# EAGLE design Micromouse v2 (EAGLE 9.6.2)
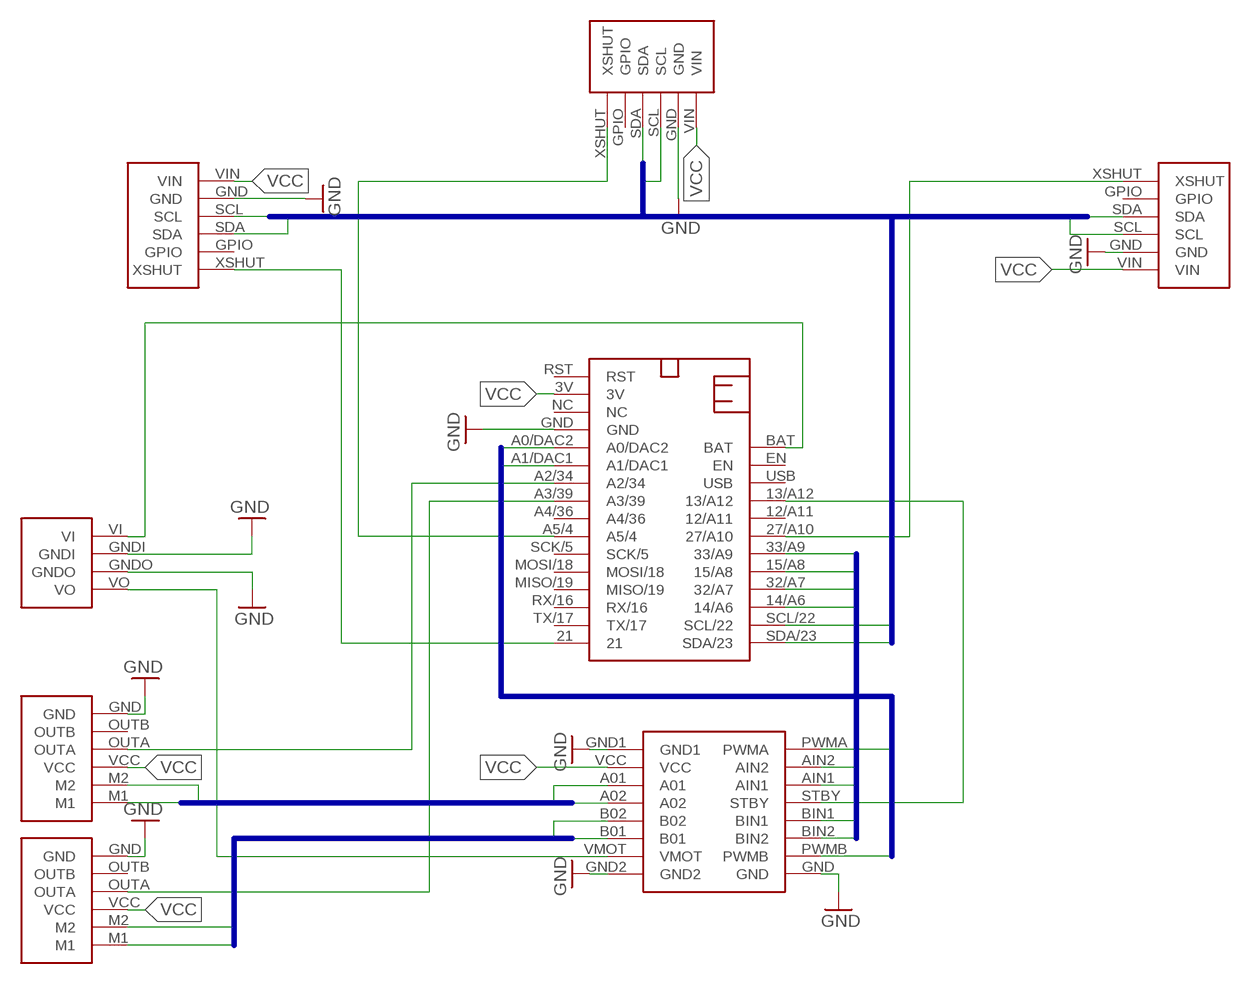
[diagram p0: schematic, sheet 1]

## Parts
12VBOOST1  12VBOOST  [12VBOOST]
ENCODE_A2  ENCODE  [ENCODE]
ENCODE_A3  ENCODE  [ENCODE]
ESP1  ESP32  [ESP32]
MOTOR1  MOTOR  [MOTOR]
VL_21  VL6180  [VL6180]
VL_27  VL6180  [VL6180]
VL_A5  VL6180  [VL6180]

## Nets
AIN1: ESP1.33/A9 MOTOR1.AIN1
AIN2: ESP1.15/A8 MOTOR1.AIN2
BIN1: ESP1.32/A7 MOTOR1.BIN1
BIN2: ESP1.14/A6 MOTOR1.BIN2
BOOST_IN [12V]: 12VBOOST1.VI ESP1.BAT
BOOST_OUT [12V]: 12VBOOST1.VO MOTOR1.VMOT
GND: 12VBOOST1.GNDI 12VBOOST1.GNDO ENCODE_A2.GND ENCODE_A3.GND ESP1.GND MOTOR1.GND MOTOR1.GND1 MOTOR1.GND2 VL_21.GND VL_27.GND VL_A5.GND
MA1 [12V]: ENCODE_A2.M1 MOTOR1.A01
MA2 [12V]: ENCODE_A2.M2 MOTOR1.A02
MB1 [12V]: ENCODE_A3.M1 MOTOR1.B01
MB2 [12V]: ENCODE_A3.M2 MOTOR1.B02
N$11: ESP1.13/A12 MOTOR1.STBY
N$15: ENCODE_A2.OUTA ESP1.A2/34
N$16: ENCODE_A3.OUTA ESP1.A3/39
N$18: ESP1.27/A10 VL_27.XSHUT
N$19: ESP1.21 VL_21.XSHUT
N$20: ESP1.A5/4 VL_A5.XSHUT
PWMA: ESP1.A1/DAC1 MOTOR1.PWMA
PWMB: ESP1.A0/DAC2 MOTOR1.PWMB
SCL: ESP1.SCL/22 VL_21.SCL VL_27.SCL VL_A5.SCL
SDA: ESP1.SDA/23 VL_21.SDA VL_27.SDA VL_A5.SDA
VCC: ENCODE_A2.VCC ENCODE_A3.VCC ESP1.3V MOTOR1.VCC VL_21.VIN VL_27.VIN VL_A5.VIN
Unconnected: ENCODE_A2.OUTB ENCODE_A3.OUTB ESP1.12/A11 ESP1.A4/36 ESP1.EN ESP1.MISO/19 ESP1.MOSI/18 ESP1.NC ESP1.RST ESP1.RX/16 ESP1.SCK/5 ESP1.TX/17 ESP1.USB VL_21.GPIO VL_27.GPIO VL_A5.GPIO

## Buses
I2C:SCL,SDA
MA:MA1,MA2
MB:MB1,MB2
PWM:PWMA,PWMB
MOTOR:AIN[1..2],BIN[1..2]

## Library data of the parts
12VBOOST1 = micromouse:12VBOOST
ENCODE_A2 ENCODE_A3 = micromouse:ENCODE
ESP1 = micromouse:ESP32
MOTOR1 = micromouse:MOTOR
VL_21 VL_27 VL_A5 = micromouse:VL6180

## Net classes
0 default: width 0.406 mm, drill 0.508 mm, clearance 0.254 mm
1 12V: width 0.61 mm, drill 0.508 mm, clearance 0.406 mm to class 0, clearance 0.406 mm

## Board
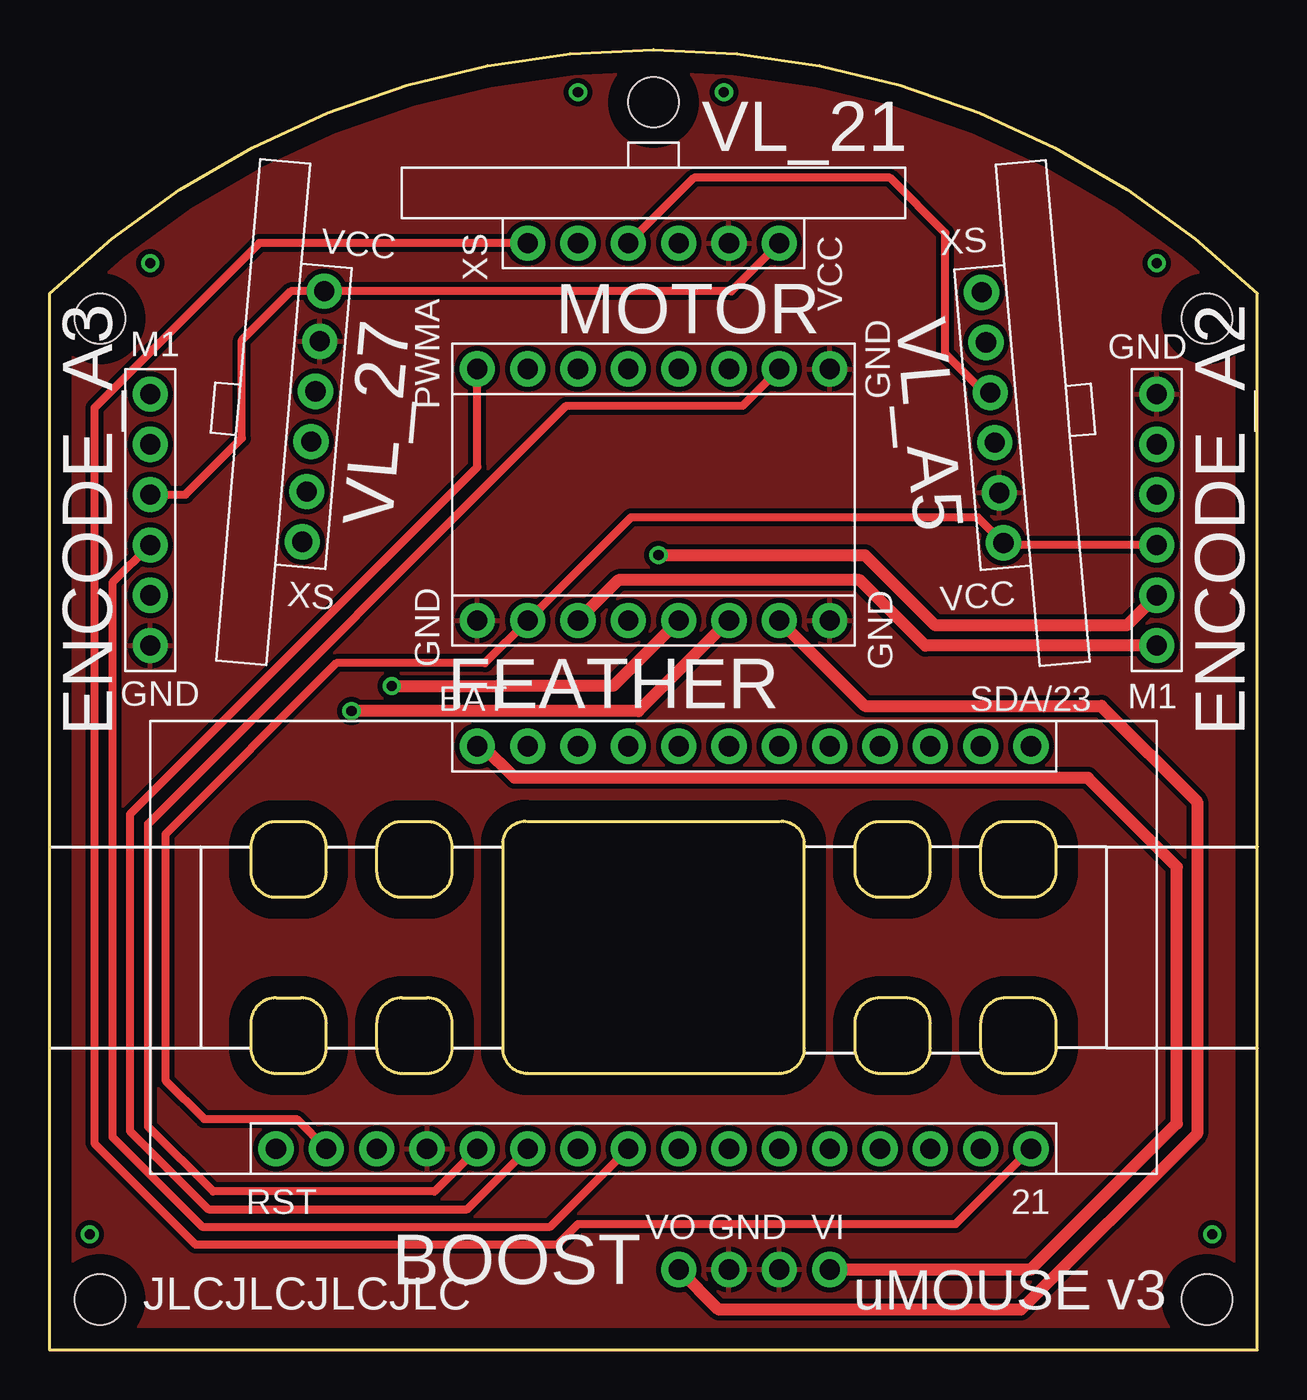
[diagram p1: board, top side]
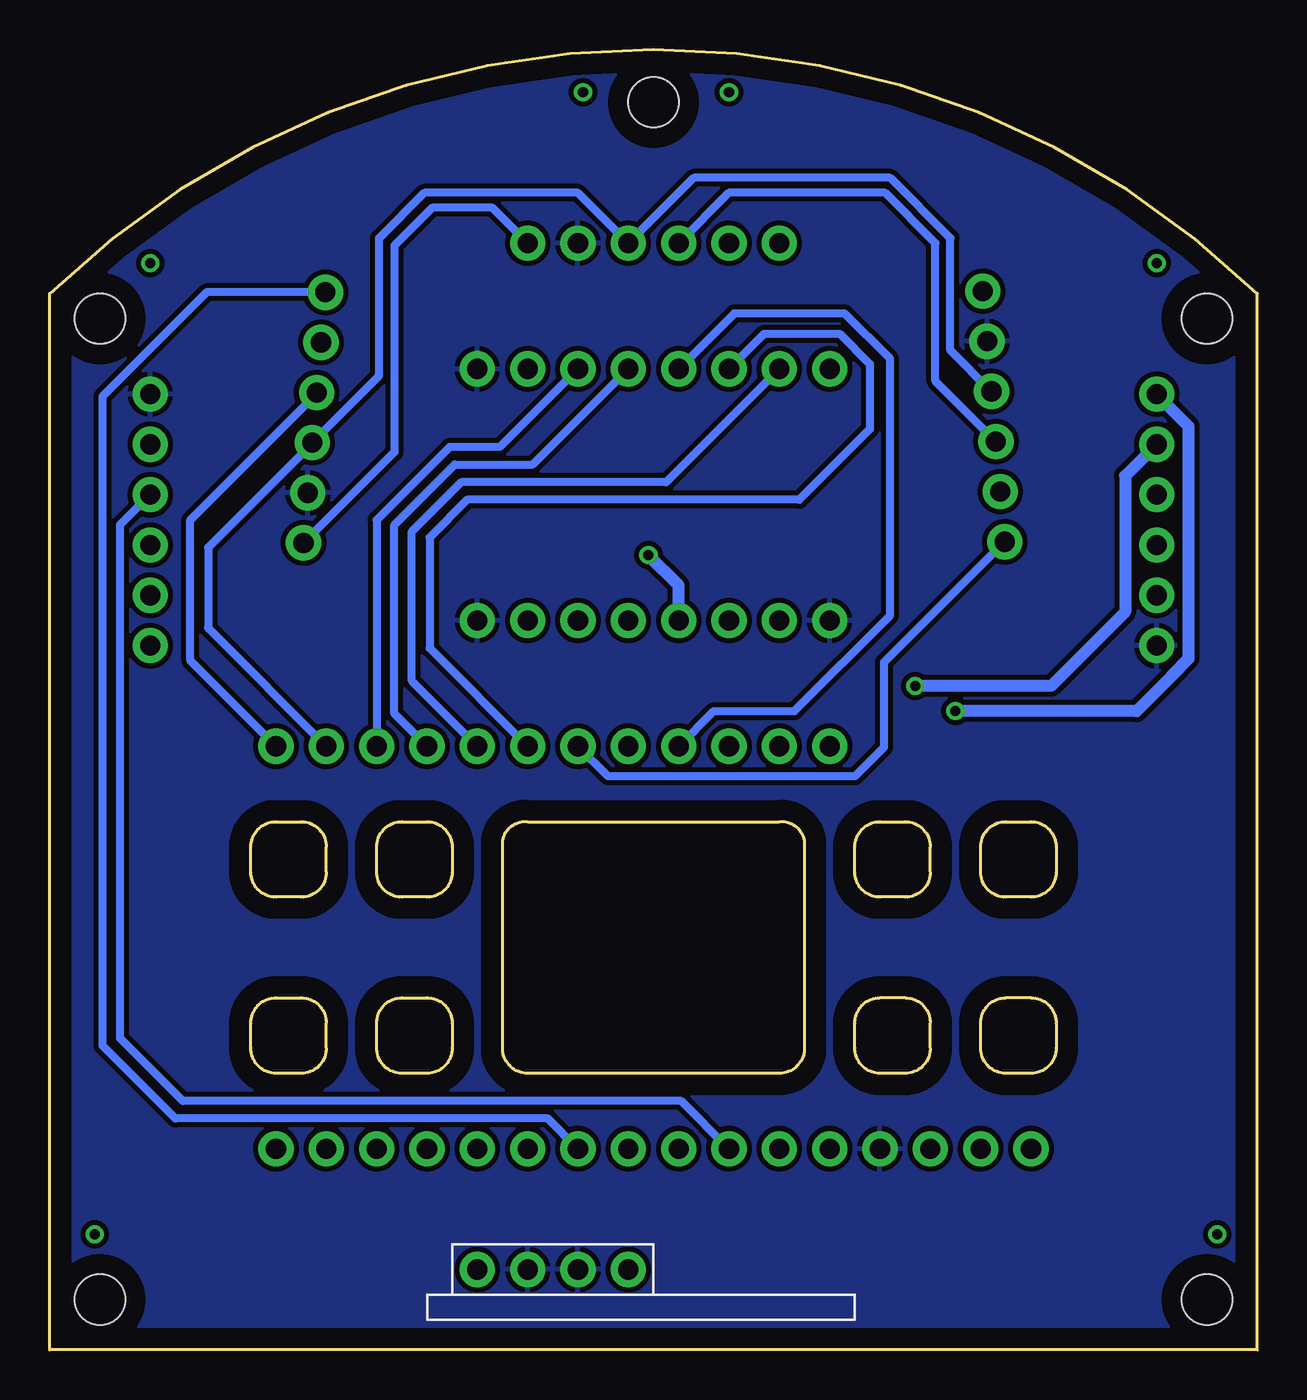
[diagram p2: board, bottom side, seen from below]

Size 60.96 x 65.65 mm. Coordinates in mm from the lower left corner, seen from the top.
Outline: 0,0 0,53.34 arc-88 60.96,53.34 60.96,0 0,0
Outline: 22.86,25.65 22.86,15.24 arc90 24.13,13.97 36.83,13.97 arc90 38.1,15.24 38.1,25.65 arc90 36.83,26.67 24.13,26.67 arc90 22.86,25.65
Outline: 20.32,24.13 20.32,25.4 arc90 19.05,26.67 17.78,26.67 arc90 16.51,25.4 16.51,24.13 arc90 17.78,22.86 19.05,22.86 arc90 20.32,24.13
Outline: 12.7,26.67 11.43,26.67 arc90 10.16,25.4 10.16,24.13 arc90 11.43,22.86 12.7,22.86 arc90 13.97,24.13 13.97,25.4 arc90 12.7,26.67
Outline: 20.32,15.24 20.32,16.51 arc90 19.05,17.78 17.78,17.78 arc90 16.51,16.51 16.51,15.24 arc90 17.78,13.97 19.05,13.97 arc90 20.32,15.24
Outline: 11.43,17.78 arc90 10.16,16.51 10.16,15.24 arc90 11.43,13.97 12.7,13.97 arc90 13.97,15.24 13.97,16.51 arc90 12.7,17.78 11.43,17.78
Outline: 50.8,15.24 50.8,16.51 arc90 49.53,17.78 48.26,17.78 arc90 46.99,16.51 46.99,15.24 arc90 48.26,13.97 49.53,13.97 arc90 50.8,15.24
Outline: 43.18,17.78 41.91,17.78 arc90 40.64,16.51 40.64,15.24 arc90 41.91,13.97 43.18,13.97 arc90 44.45,15.24 44.45,16.51 arc90 43.18,17.78
Outline: 50.8,24.13 50.8,25.4 arc90 49.53,26.67 48.26,26.67 arc90 46.99,25.4 46.99,24.13 arc90 48.26,22.86 49.53,22.86 arc90 50.8,24.13
Outline: 43.18,26.67 41.91,26.67 arc90 40.64,25.4 40.64,24.13 arc90 41.91,22.86 43.18,22.86 arc90 44.45,24.13 44.45,25.4 arc90 43.18,26.67
Copper layers (1*16): Top 0.035mm / dielectric 1.5mm / Bottom 0.035mm
Design rules "default": minimum track width 6mil, minimum drill 0.35mm, track to track 6mil, track to pad 6mil, pad to pad 6mil, via to via 6mil, smd to smd 6mil, copper to edge 40mil, drill to drill 6mil, minimum pad ring 10mil, minimum via ring 8mil, stop-mask expansion 4mil, vias tented up to drill 0mil, thermal gap 10mil
Holes 2.54 mm at 30.48,62.99 2.54,52.07 2.54,2.54 58.42,2.54 58.42,52.07

### Footprints (pad centres in the part's own frame; a part is rotated, then mirrored left to right if it is on the bottom)
12VBOOST = drill 1.016 pad 1.778: GNDI 6.35,1.27; GNDO 3.81,1.27; VI 8.89,1.27; VO 1.27,1.27
ENCODE = drill 1.016 pad 1.778: GND 1.27,1.27; M1 1.27,13.97; M2 1.27,11.43; OUTA 1.27,6.35; OUTB 1.27,3.81; VCC 1.27,8.89
ESP32 = drill 1.016 pad 1.778: 3V 1.27,41.91; 12/A11 21.59,24.13; 13/A12 21.59,26.67; 14/A6 21.59,11.43; 15/A8 21.59,16.51; 21 1.27,6.35; 27/A10 21.59,21.59; 32/A7 21.59,13.97; 33/A9 21.59,19.05; A0/DAC2 1.27,34.29; A1/DAC1 1.27,31.75; A2/34 1.27,29.21; A3/39 1.27,26.67; A4/36 1.27,24.13; A5/4 1.27,21.59; BAT 21.59,34.29; EN 21.59,31.75; GND 1.27,36.83; MISO/19 1.27,13.97; MOSI/18 1.27,16.51; NC 1.27,39.37; RST 1.27,44.45; RX/16 1.27,11.43; SCK/5 1.27,19.05; SCL/22 21.59,8.89; SDA/23 21.59,6.35; TX/17 1.27,8.89; USB 21.59,29.21
MOTOR = drill 1.016 pad 1.778: A01 1.27,13.97; A02 1.27,11.43; AIN1 13.97,13.97; AIN2 13.97,16.51; B01 1.27,6.35; B02 1.27,8.89; BIN1 13.97,8.89; BIN2 13.97,6.35; GND 13.97,1.27; GND1 1.27,19.05; GND2 1.27,1.27; PWMA 13.97,19.05; PWMB 13.97,3.81; STBY 13.97,11.43; VCC 1.27,16.51; VMOT 1.27,3.81
VL6180 = drill 1.016 pad 1.778: GND 1.27,3.81; GPIO 1.27,11.43; SCL 1.27,6.35; SDA 1.27,8.89; VIN 1.27,1.27; XSHUT 1.27,13.97

### Placement (x,y rotation side)
12VBOOST1  30.48,5.33 180 bottom
ENCODE_A2  57.15,49.53 180 top
ENCODE_A3  3.81,34.29 0 top
ESP1  55.88,8.89 90 top
MOTOR1  40.64,35.56 90 top
VL_21  38.1,54.61 90 top
VL_27  15.24,54.61 175 top
VL_A5  46.99,39.37 5 top

### Tracks (layer width: path | path; a pad name or v marks a point on that pad's centre or on a via)
AIN1
  Bottom 0.406: ESP1.33/A9 41.78,35.43 41.78,41.02 39.88,42.93 23.11,42.93 19.56,46.48 19.56,49.78 21.08,51.31 24.89,51.31 MOTOR1.AIN1
AIN2
  Bottom 0.406: ESP1.15/A8 42.67,33.78 42.67,41.32 40.18,43.81 29.84,43.81 MOTOR1.AIN2
BIN1
  Bottom 0.406: ESP1.32/A7 43.56,32.13 43.56,41.66 40.51,44.7 36.58,44.7 MOTOR1.BIN1
BIN2
  Bottom 0.406: MOTOR1.BIN2 38.23,45.59 40.77,45.59 44.45,41.91 ESP1.14/A6
BOOST_IN
  Top 0.61: 12VBOOST1.VI 49.53,4.06 56.9,11.43 56.9,24.38 52.4,28.88 23.47,28.88 21.87,30.48 ESP1.BAT
BOOST_OUT
  Top 0.61: MOTOR1.VMOT 41.15,32.51 53.09,32.51 57.91,27.69 57.91,10.92 49.02,2.03 33.78,2.03 12VBOOST1.VO
GND
  pour Bottom: -2.54,-2.54 63.5,-2.54 63.5,68.58 -2.54,68.58
  pour Top: -1.27,-1.27 62.23,-1.27 62.23,66.04 0,66.04 -1.27,66.04
MA1
  Top 0.61: ENCODE_A2.M1 44.2,35.56 40.89,38.86 28.7,38.86 MOTOR1.A01
MA2  (via drill 0.51)
  Top 0.61: v30.73,40.13 41.15,40.13 44.7,36.58 54.36,36.58 ENCODE_A2.M2
  Bottom 0.61: MOTOR1.A02 29.21,38.61 v30.73,40.13
MB1  (via drill 0.51)
  Top 0.61: MOTOR1.B01 29.72,32.26 v15.24,32.26
  Bottom 0.61: ENCODE_A3.M1 5.08,48.24 3.48,46.64 3.48,34.9 4.32,34.06 4.32,34.04 6.1,32.26 v15.24,32.26
MB2  (via drill 0.51)
  Top 0.61: MOTOR1.B02 28.45,33.53 22.61,33.53 v17.27,33.53
  Bottom 0.61: ENCODE_A3.M2 6.68,44.12 6.68,37.26 10.41,33.53 v17.27,33.53
N$1  (via drill 0.51)
  other vias: 5.08,54.86
N$2  (via drill 0.51)
  other vias: 26.67,63.5
N$3  (via drill 0.51)
  other vias: 34.04,63.5
N$4  (via drill 0.51)
  other vias: 55.88,54.86
N$5  (via drill 0.51)
  other vias: 2.03,5.84
N$6  (via drill 0.51)
  other vias: 58.67,5.84
N$11
  Bottom 0.406: ESP1.13/A12 27.43,32.26 23.37,32.26 18.54,37.08 18.54,50.04 20.83,52.32 26.42,52.32 MOTOR1.STBY
N$15
  Bottom 0.406: ENCODE_A2.OUTA 57.4,41.66 57.4,15.75 54.23,12.57 29.08,12.57 ESP1.A2/34
N$16
  Top 0.406: ENCODE_A3.OUTA 3.17,38.73 3.17,10.75 7.7,6.22 25.27,6.22 ESP1.A3/39
N$18
  Bottom 0.406: VL_27.XSHUT 18.85,34.71 18.85,30.42 20.32,28.96 32.77,28.96 ESP1.27/A10
N$19
  Top 0.406: VL_21.XSHUT 10.58,55.88 2.26,47.56 2.26,10.44 7.37,5.33 25.65,5.33 26.67,6.35 45.72,6.35 ESP1.21
N$20
  Bottom 0.406: VL_A5.XSHUT 53.03,53.4 58.29,48.13 58.29,15.37 54.61,11.68 35.81,11.68 ESP1.A5/4
PWMA
  Top 0.406: MOTOR1.PWMA 21.59,44.58 4.06,27.05 4.06,11.05 8,7.11 21.08,7.11 ESP1.A1/DAC1
PWMB
  Top 0.406: ESP1.A0/DAC2 19.43,8 8.26,8 4.98,11.28 4.98,26.57 26.09,47.68 34.98,47.68 MOTOR1.PWMB
SCL
  Bottom 0.406: VL_27.SCL 15.49,50.47 15.49,56.13 18.54,59.18 28.45,59.18 VL_21.SCL 34.29,58.42 42.04,58.42 44.32,56.13 44.32,49.19 VL_A5.SCL 47.7,45.77 52.96,40.51 52.96,36.45 ESP1.SCL/22
SDA
  Top 0.406: VL_21.SDA 32.51,59.18 42.42,59.18 45.21,56.39 45.21,50.29 47.17,48.34 VL_A5.SDA
  Bottom 0.406: VL_27.SDA 16.26,48.92 16.26,55.88 18.8,58.42 26.67,58.42 VL_21.SDA | ESP1.SDA/23 53.85,34.8 53.85,41.91 47.48,48.28 VL_A5.SDA
VCC
  Top 0.406: ENCODE_A2.VCC 48.25,40.64 VL_A5.VIN 46.85,42.04 29.34,42.04 MOTOR1.VCC 21.97,34.67 14.48,34.67 5.84,26.04 5.84,13.62 7.8,11.66 12.47,11.66 ESP1.3V | VL_21.VIN 34.41,53.46 VL_27.VIN 12.18,53.46 9.71,50.99 9.71,46.03 6.86,43.18 ENCODE_A3.VCC
  Bottom 0.406: VL_21.VIN 38.61,57.66 41.66,57.66 43.56,55.75 43.56,45.33 VL_A5.VIN

### Text on the board
tNames: JLCJLCJLCJLC | uMOUSE v3